# EAGLE design 2out_16A_bi_TS-ARM_V1.0 (EAGLE 6.3)
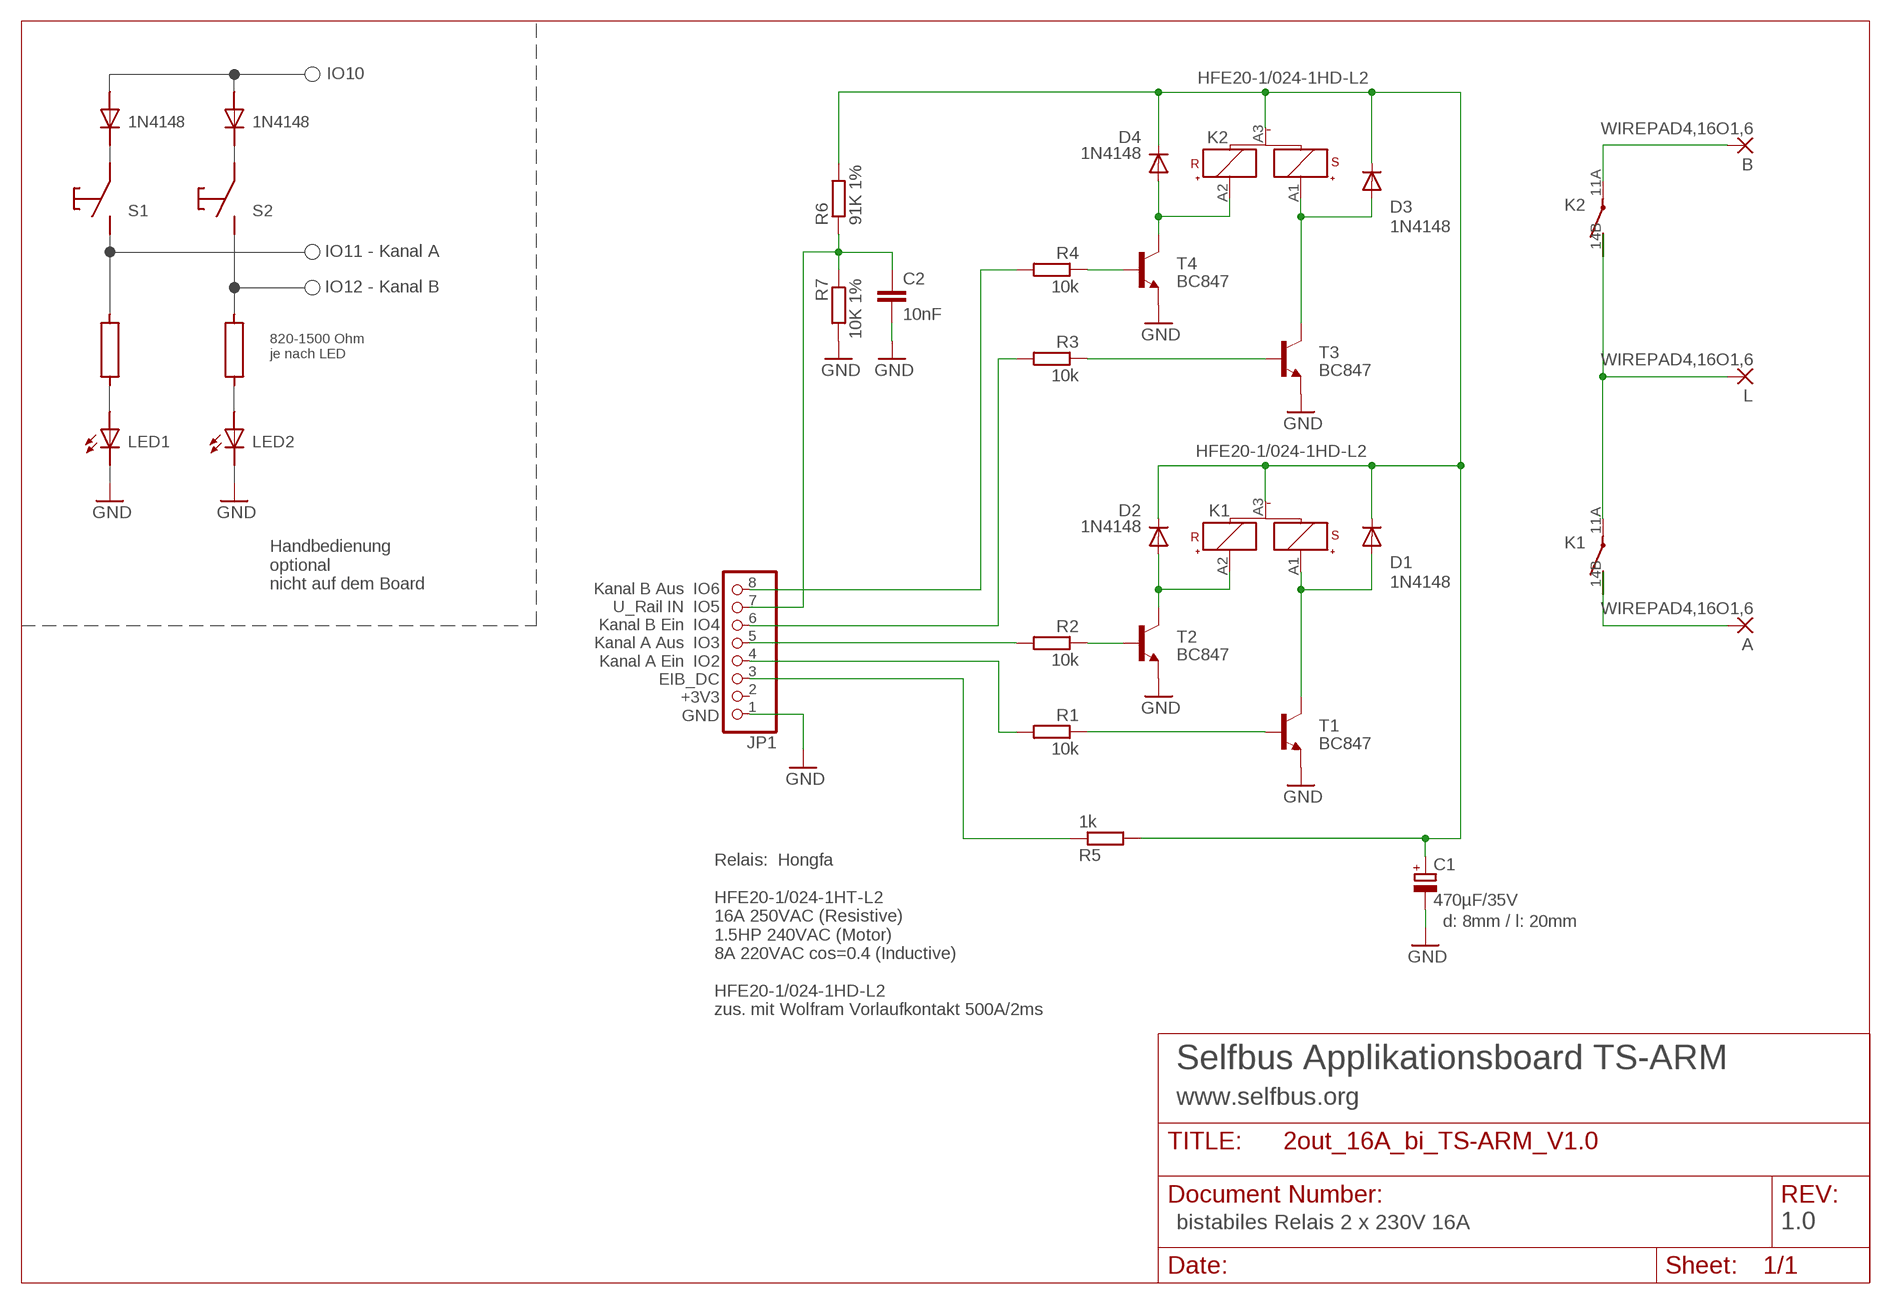
[diagram p0: schematic, sheet 1]

## Parts
A  WIREPAD4,16O1,6  [4,16O1,6]
B  WIREPAD4,16O1,6  [4,16O1,6]
C1  470µF/35V  CPOL-EUE3.5-8  [E3,5-8]
C2  10nF  C-EUC1206K  [C1206K]
D1  1N4148  DIODE-MINIMELF  [MINIMELF]
D2  1N4148  DIODE-MINIMELF  [MINIMELF]
D3  1N4148  DIODE-MINIMELF  [MINIMELF]
D4  1N4148  DIODE-MINIMELF  [MINIMELF]
JP1  PINHD-1X8  [1X08]
K1  HFE20-1/024-1HD-L2  RT314F24  [RT1-BI]
K2  HFE20-1/024-1HD-L2  RT314F24  [RT1-BI]
L  WIREPAD4,16O1,6  [4,16O1,6]
R1  10k  R-EU_M1206  [M1206]
R2  10k  R-EU_M1206  [M1206]
R3  10k  R-EU_M1206  [M1206]
R4  10k  R-EU_M1206  [M1206]
R5  1k  R-EU_M1206  [M1206]
R6  91K 1%  R-EU_M1206  [M1206]
R7  10K 1%  R-EU_M1206  [M1206]
T1  BC847  [SOT23]
T2  BC847  [SOT23]
T3  BC847  [SOT23]
T4  BC847  [SOT23]
U$1  R_NUR_SCHALTPLAN  [LEER]
U$2  TASTE_NUR_SCHALTPLAN  [LEER]
U$3  LED_NUR_SCHALTPLAN  [LEER]
U$4  DIODE_NUR_SCHALTPLAN  [LEER]
U$5  R_NUR_SCHALTPLAN  [LEER]
U$6  TASTE_NUR_SCHALTPLAN  [LEER]
U$7  LED_NUR_SCHALTPLAN  [LEER]
U$8  DIODE_NUR_SCHALTPLAN  [LEER]

## Nets
GND: C1.- C2.2 JP1.1 R7.2 T1.2(E) T2.2(E) T3.2(E) T4.2(E)
N$1: R1.1 T1.1(B)
N$2: JP1.5 R2.2
N$4: A.1(P) K1.14B(SA)
N$5: B.1(P) K2.11A(PA)
N$6: K1.11A(PA) K2.14B(SA) L.1(P)
N$7: R2.1 T2.1(B)
N$8: JP1.6 R3.2
N$9: C2.1 JP1.7 R6.1 R7.1
N$10: D2.A K1.A2(1:R+) T2.3(C)
N$14: JP1.3 R5.1
N$15: JP1.4 R1.2
N$17: R3.1 T3.1(B)
N$18: R4.1 T4.1(B)
N$19: JP1.8 R4.2
R1: D1.A K1.A1(1:S+) T1.3(C)
R2: D4.A K2.A2(1:R+) T4.3(C)
R4: D3.A K2.A1(1:S+) T3.3(C)
VDD_REL: C1.+ D1.C D2.C D3.C D4.C K1.A3(1:-) K2.A3(1:-) R5.2 R6.2
Unconnected: JP1.2

## Notes on the sheet
- IO10
- 1N4148 | 1N4148
- S1 | S2
- IO11 - Kanal A
- IO12 - Kanal B
- 820-1500 Ohm
  je nach LED
- LED1 | LED2
- Handbedienung
  optional
  nicht auf dem Board
- Kanal B Aus  IO6
  U_Rail IN  IO5
  Kanal B Ein  IO4
  Kanal A Aus  IO3
  Kanal A Ein  IO2
  EIB_DC
  +3V3
  GND
- d: 8mm / l: 20mm
- Relais:  Hongfa
  
  HFE20-1/024-1HT-L2
  16A 250VAC (Resistive)
  1.5HP 240VAC (Motor)
  8A 220VAC cos=0.4 (Inductive)
  
  HFE20-1/024-1HD-L2
  zus. mit Wolfram Vorlaufkontakt 500A/2ms
- Selfbus Applikationsboard TS-ARM
- www.selfbus.org
- bistabiles Relais 2 x 230V 16A | 1.0

## Library data of the parts
A B L = wirepad:WIREPAD: Wire PAD connect wire on PCB
C1 = rcl:CPOL-EU: POLARIZED CAPACITOR, European symbol
C2 = rcl:C-EU: CAPACITOR, European symbol
D1-D4 = diode:DIODE-: DIODE
JP1 = pinhead:PINHD-1X8: PIN HEADER
K1 K2 = meine_lib:RT?F*: Power PCB Relay SCHRACK bistable 1 pole 16 A, polarized bistable version Source: http://www.schrack.com/.. 5821.pdf; MPN: RT314F24; OC_FARNELL: 1175084; OC_NEWARK: 31M5918
R1-R7 = rcl:R-EU_: RESISTOR, European symbol
T1-T4 = transistor:BC847: NPN TRANSISTOR
U$1 U$5 = Uwe:R_NUR_SCHALTPLAN
U$2 U$6 = Uwe:TASTE_NUR_SCHALTPLAN
U$3 U$7 = Uwe:LED_NUR_SCHALTPLAN
U$4 U$8 = Uwe:DIODE_NUR_SCHALTPLAN

## Board
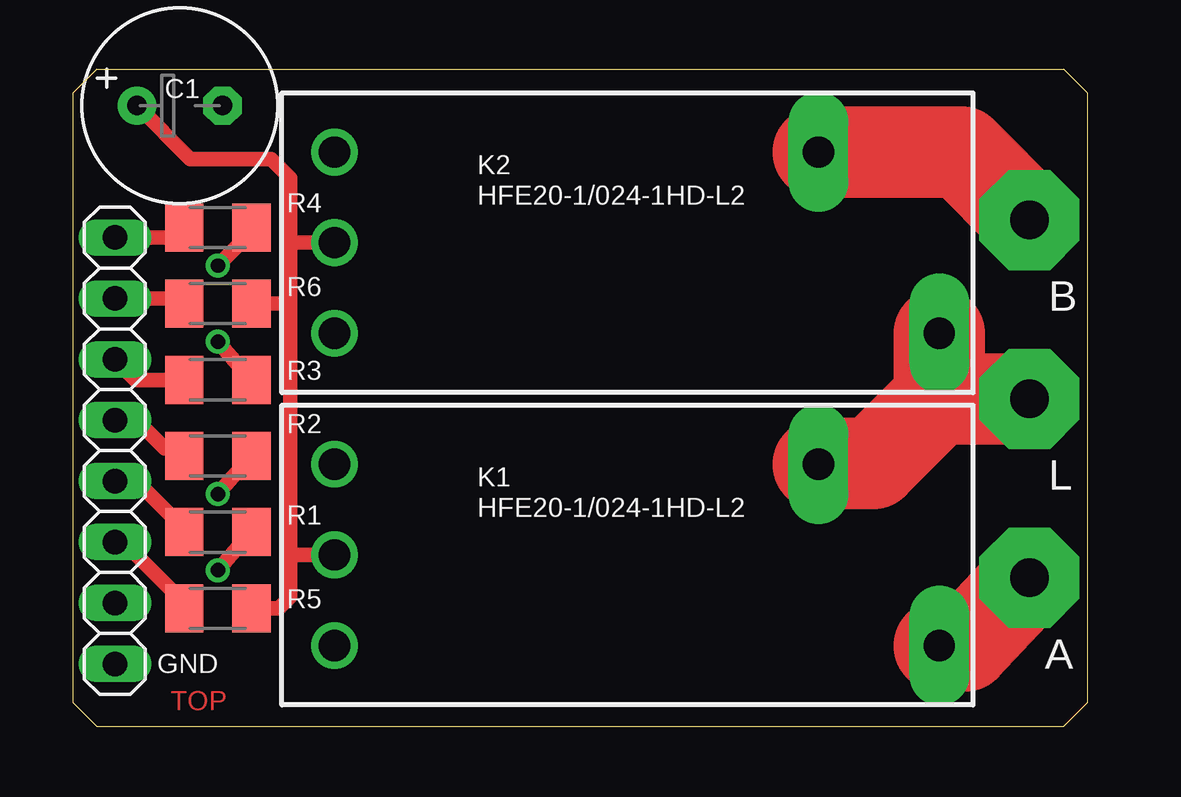
[diagram p1: board, top side]
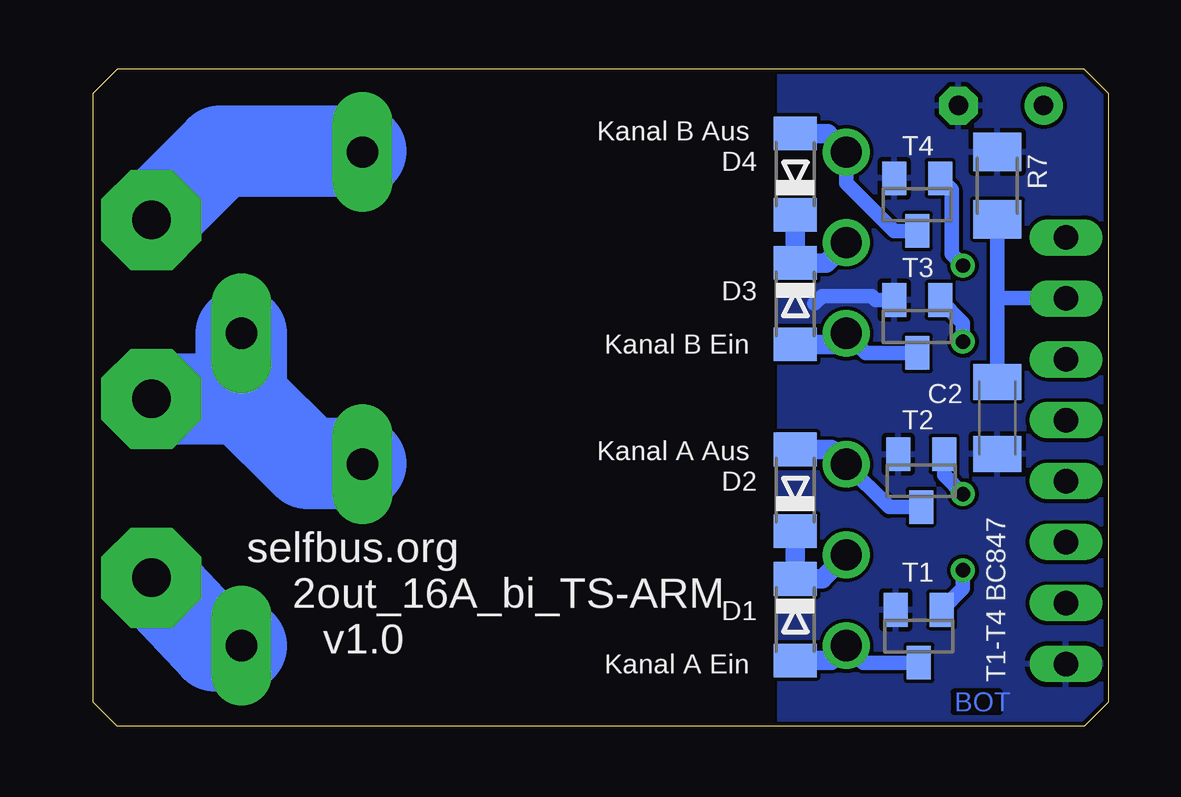
[diagram p2: board, bottom side, seen from below]

Size 42.3 x 27.4 mm. Coordinates in mm from the lower left corner, seen from the top.
Outline: 1,0 41.3,0 42.3,1 42.3,26.4 41.3,27.4 1,27.4 0,26.4 0,1 1,0
Copper layers (1*16): Top 0.035mm / dielectric 1.5mm / Bottom 0.035mm
Design rules "platinensammler_02 *": minimum track width 0.15mm, minimum drill 0.3mm, track to track 0.15mm, track to pad 0.15mm, pad to pad 0.15mm, via to via 0.15mm, smd to smd 0mil, copper to edge 0.2mm, drill to drill 0.2mm, minimum pad ring 0.2mm, minimum via ring 0.2mm, stop-mask expansion 4mil, vias tented up to drill 0.8mm, thermal gap 0.2mm

### Footprints (pad centres in the part's own frame; a part is rotated, then mirrored left to right if it is on the bottom)
4,16O1,6 = drill 1.6 pad 4.166 octagon: 1 0,0
E3,5-8 = drill 0.813 pad 1.6: + -1.778,0 | drill 0.813 pad 1.6 octagon: - 1.778,0
C1206K = smd 1.5 x 2: 1 -1.5,0; 2 1.5,0
MINIMELF = smd 1.4 x 1.8: A 1.7,0; C -1.7,0
1X08 = drill 1.016 long: 1 -8.89,0; 2 -6.35,0; 3 -3.81,0; 4 -1.27,0; 5 1.27,0; 6 3.81,0; 7 6.35,0; 8 8.89,0
RT1-BI = drill 1.3 pad 2.5 long: 11A 7.56,3.78; 14B 12.6,-3.78 | drill 1.3: A1 -12.6,-3.78; A2 -12.6,3.78; A3 -12.6,0
M1206 = smd 1.6 x 2: 1 -1.4,0; 2 1.4,0
SOT23 = smd 1 x 1.4: 1 -0.95,-1.1; 2 0.95,-1.1; 3 0,1.1

### Placement (x,y rotation side)
A  39.87,6.19 0 top
B  39.87,21.11 0 top
C1  4.47,25.88 0 top
C2  4.63,12.86 270 bottom
D1  13.04,4.44 270 bottom
D2  13.04,9.84 90 bottom
D3  13.04,17.62 270 bottom
D4  13.04,23.02 90 bottom
JP1  1.76,11.49 90 top
K1  23.52,7.14 0 top
K2  23.52,20.16 0 top
L  39.87,13.65 0 top
R1  6.05,8.1 180 top
R2  6.05,11.27 180 top
R3  6.05,14.45 180 top
R4  6.05,20.8 180 top
R5  6.05,4.92 0 top
R6  6.05,17.62 0 top
R7  4.63,22.54 90 bottom
T1  7.9,3.75 180 bottom
T2  7.79,10.24 180 bottom
T3  7.96,16.67 180 bottom
T4  7.96,21.75 180 bottom
U$1  0.34,-0.79 0 top
U$2  0.34,-0.79 0 top
U$3  0.34,-0.79 0 top
U$4  0.34,-0.79 0 top
U$5  0.34,-0.79 0 top
U$6  0.34,-0.79 0 top
U$7  0.34,-0.79 0 top
U$8  0.34,-0.79 0 top

### Tracks (layer width: path | path; a pad name or v marks a point on that pad's centre or on a via)
GND
  Bottom 0.61: T2.2 8.59,11.49 8.75,11.65 | T4.2 | T3.2 9.69,17.77 9.86,17.94 11.93,17.94 12.25,17.62
  pour Bottom: 0.97,0.16 13.67,0.16 13.67,27.46 0.97,27.46 0.02,26.51 0.02,1.11
N$1  (via drill 0.6)
  Top 0.61: R1.1 v6.05,6.51
  Bottom 0.61: v6.05,6.51 6.05,5.75 T1.1
N$2
  Top 0.61: JP1.5 1.98,12.54 2.88,12.54 3.83,11.59 4.15,11.59 4.47,11.27 R2.2
N$4
  Top 3.81: K1.14B 37.2,3.36 A.1
  Bottom 3.81: K1.14B 37.2,3.36 A.1
N$5
  Top 3.81: B.1 37.04,23.94 K2.11A
  Bottom 3.81: B.1 37.01,23.97 31.14,23.97
N$6
  Top 3.81: L.1 36.06,13.65 | 36.06,13.65 33.36,10.95 31.11,10.95 K1.11A | K2.14B 36.12,13.71 36.06,13.65
  Bottom 3.81: L.1 36.06,13.65 33.36,10.95 31.14,10.95 | K2.14B 36.12,13.91 36.22,13.81
N$7  (via drill 0.6)
  Top 0.61: R2.1 v6.05,9.68
  Bottom 0.61: T2.1 6.84,10.47 v6.05,9.68
N$8
  Top 0.61: JP1.6 2.62,14.45 R3.2
N$9
  Top 0.61: JP1.7 4.65,17.84 R6.1
  Bottom 0.61: R7.1 4.63,17.85 | 4.63,17.85 C2.1 | 4.63,17.85 1.77,17.85 JP1.7
N$10
  Bottom 0.61: T2.3 9.14,9.14 K1.A2
  Bottom 0.813: K1.A2 11.54,11.54 D2.A
N$14
  Top 0.61: JP1.3 2.4,7.68 2.41,7.68 2.41,7.39 4.1,5.7 R5.1
N$15
  Top 0.61: JP1.4 1.98,10 2.88,10 4.65,8.23 R1.2
N$17  (via drill 0.6)
  Top 0.61: R3.1 v6.05,16.03
  Bottom 0.61: T3.1 6.05,16.81 v6.05,16.03
N$18  (via drill 0.6)
  Top 0.61: R4.1 7.45,20.61 v6.05,19.21
  Bottom 0.61: T4.1 6.53,22.37 6.53,19.68 v6.05,19.21
N$19
  Top 0.61: JP1.8 4.65,20.38 R4.2
R1
  Bottom 0.61: T1.3 10.21,2.65 K1.A1
  Bottom 0.813: K1.A1 11.54,2.74 D1.A
R2
  Bottom 0.61: T4.3 8.92,20.65 10.92,22.64 K2.A2
  Bottom 0.813: K2.A2 11.69,24.72 D4.A
R4
  Bottom 0.61: T3.3 10.1,15.57 K2.A1
  Bottom 0.813: K2.A1 11.38,15.92 D3.A
VDD_REL
  Top 0.61: R5.2 8.59,4.92 9.07,5.4 9.07,7.14 | 9.07,7.14 9.07,17.62 | 9.07,17.62 9.07,20.16 | K2.A3 9.07,20.16 | R6.2 9.07,17.62 | 9.07,20.16 9.07,22.86 8.28,23.65 4.91,23.65 C1.+ | K1.A3 9.07,7.14
  Bottom 0.813: D4.C D3.C 11.76,19.32 K2.A3 | K1.A3 11.92,6.14 D1.C D2.C

### Text on the board
Top: TOP
Bottom: BOT
tNames: GND
bNames: Kanal B Aus | Kanal B Ein | Kanal A Aus | T1-T4 BC847 | selfbus.org | 2out_16A_bi_TS-ARM | Kanal A Ein | v1.0
Document: Kanal B Aus IO6 / U_Rail IN IO5 / Kanal B Ein IO4 / Kanal A Aus IO3 / Kanal A Ein IO2 / EIB_DC / +3V3 / GND